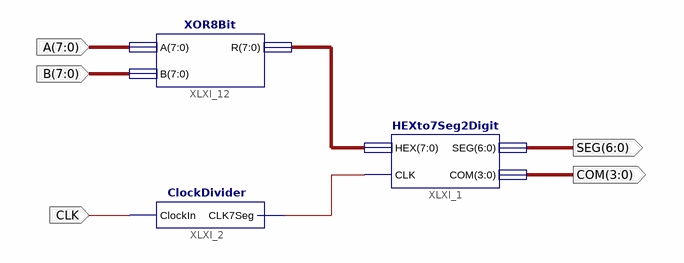
[diagram p0: schematic sheet 1]
// Xilinx ISE schematic ALU.sch (spartan6) as structural Verilog: 3 symbols, 5 ports
module ALU (
  input  CLK,
  input  [7:0] A,
  input  [7:0] B,
  output [6:0] SEG,
  output [3:0] COM
);

  wire XLXN_2;
  wire [7:0] LED;

  HEXto7Seg2Digit XLXI_1 (.HEX(LED), .CLK(XLXN_2), .SEG(SEG), .COM(COM));
  ClockDivider XLXI_2 (.ClockIn(CLK), .CLK7Seg(XLXN_2));
  XOR8Bit XLXI_12 (.A(A), .B(B), .R(LED));
endmodule
